# Altium schematic sheet [01] - PCU_MODULE.SchDoc
size 297 x 209 mm; CompanyName: Wave; SheetNumber: 2; SheetTotal: 5; PRJ_SheetSize: A4
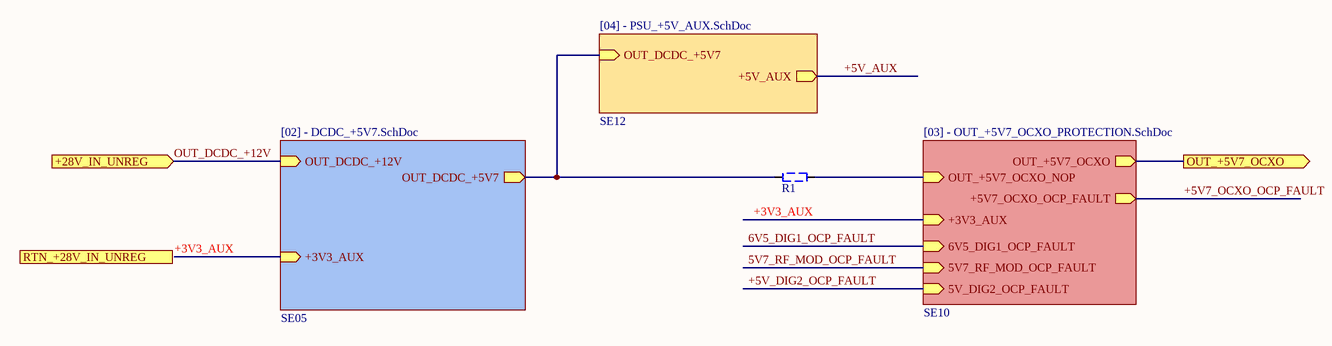
[diagram p0: [01] - PCU_MODULE.SchDoc]

## Parts
R1  NoBom  [RESC1608X50N]  (value not drawn)  (no BOM)

## Sub-sheets
SE05 = [02] - DCDC_+5V7.SchDoc: OUT_DCDC_+12V (in), +3V3_AUX (in), OUT_DCDC_+5V7 (out)
SE10 = [03] - OUT_+5V7_OCXO_PROTECTION.SchDoc: OUT_+5V7_OCXO_NOP (in), +3V3_AUX (in), OUT_+5V7_OCXO (out), +5V7_OCXO_OCP_FAULT (out), 6V5_DIG1_OCP_FAULT (in), 5V7_RF_MOD_OCP_FAULT (in), 5V_DIG2_OCP_FAULT (in)
SE12 = [04] - PSU_+5V_AUX.SchDoc: OUT_DCDC_+5V7 (in), +5V_AUX (out)

## Ports
+28V_IN_UNREG (in, see [00] - INTERFACES_BOARD[4C]), OUT_+5V7_OCXO (out, see [00] - INTERFACES_BOARD[5B], [03] - OUT_+5V7_OCXO_PROTECTION[4A]), RTN_+28V_IN_UNREG (see [00] - INTERFACES_BOARD[4C])

## Nets
5V7_RF_MOD_OCP_FAULT: sheet SE10/5V7_RF_MOD_OCP_FAULT
6V5_DIG1_OCP_FAULT: sheet SE10/6V5_DIG1_OCP_FAULT
+3V3_AUX: sheet SE05/+3V3_AUX, sheet SE10/+3V3_AUX
+5V7_OCXO_OCP_FAULT: sheet SE10/+5V7_OCXO_OCP_FAULT
+5V_AUX: sheet SE12/+5V_AUX
+5V_DIG2_OCP_FAULT: sheet SE10/5V_DIG2_OCP_FAULT
OUT_+5V7_OCXO: port OUT_+5V7_OCXO, sheet SE10/OUT_+5V7_OCXO
OUT_DCDC_+12V: port +28V_IN_UNREG, sheet SE05/OUT_DCDC_+12V
NetR1_1: R1.1 ; sheet SE05/OUT_DCDC_+5V7, sheet SE12/OUT_DCDC_+5V7
NetR1_2: R1.2 ; sheet SE10/OUT_+5V7_OCXO_NOP

## Notes on the sheet
- Part Number:
- Description:
- Document:
- Date:
- Size:
- Sheet Title:
- Sheet
- of
- Author:
- MOD. COD.:

## Library data of the parts
R1 = 1RES_NO_BOM: Resistore Non in BOM; Category: Resistors